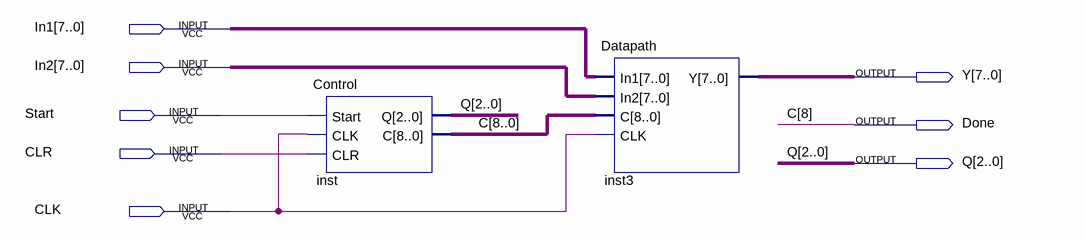
[diagram p0: schematic sheet]
// Quartus schematic Bai1.bdf as structural Verilog: 2 symbols, 8 pins
module Bai1 (
  input  [7:0] In1,
  input  [7:0] In2,
  input  Start,
  input  CLR,
  input  CLK,
  output [7:0] Y,
  output Done,
  output [2:0] Q
);

  wire [7:0] C;

  Control inst (.Start(Start), .CLK(CLK), .CLR(CLR), .Q(Q), .C({Done, C}));
  Datapath inst3 (.In1(In1), .In2(In2), .C({Done, C}), .CLK(CLK), .Y(Y));

  // Other names for the same wires on the sheet: C[8] = Done
endmodule
